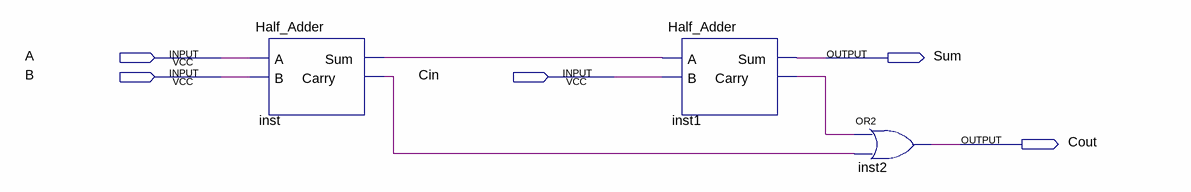
[diagram p0: schematic sheet]
// Quartus schematic Full_Adder.bdf as structural Verilog: 3 symbols, 5 pins
module Full_Adder (
  input  A,
  input  B,
  input  Cin,
  output Sum,
  output Cout
);

  wire inst1_carry, inst_carry, inst_sum;

  Half_Adder inst (.A(A), .B(B), .Sum(inst_sum), .Carry(inst_carry));
  Half_Adder inst1 (.A(inst_sum), .B(Cin), .Sum(Sum), .Carry(inst1_carry));
  or inst2 (Cout, inst1_carry, inst_carry);
endmodule
